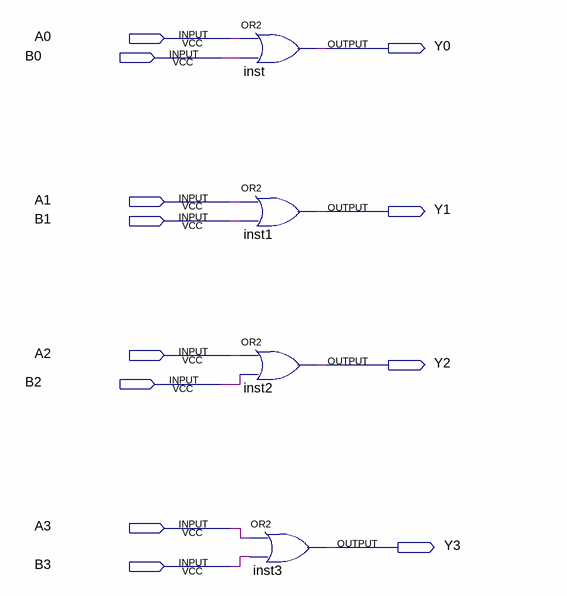
[diagram p0: schematic sheet]
// Quartus schematic bitwiseOR.bdf as structural Verilog: 4 symbols, 12 pins
module bitwiseOR (
  input  A0,
  input  B0,
  input  A1,
  input  B1,
  input  A2,
  input  B2,
  input  A3,
  input  B3,
  output Y0,
  output Y1,
  output Y2,
  output Y3
);

  or inst (Y0, A0, B0);
  or inst1 (Y1, A1, B1);
  or inst2 (Y2, A2, B2);
  or inst3 (Y3, A3, B3);
endmodule
